# EAGLE design 180 schematic 3 layer (EAGLE 9.6.2)
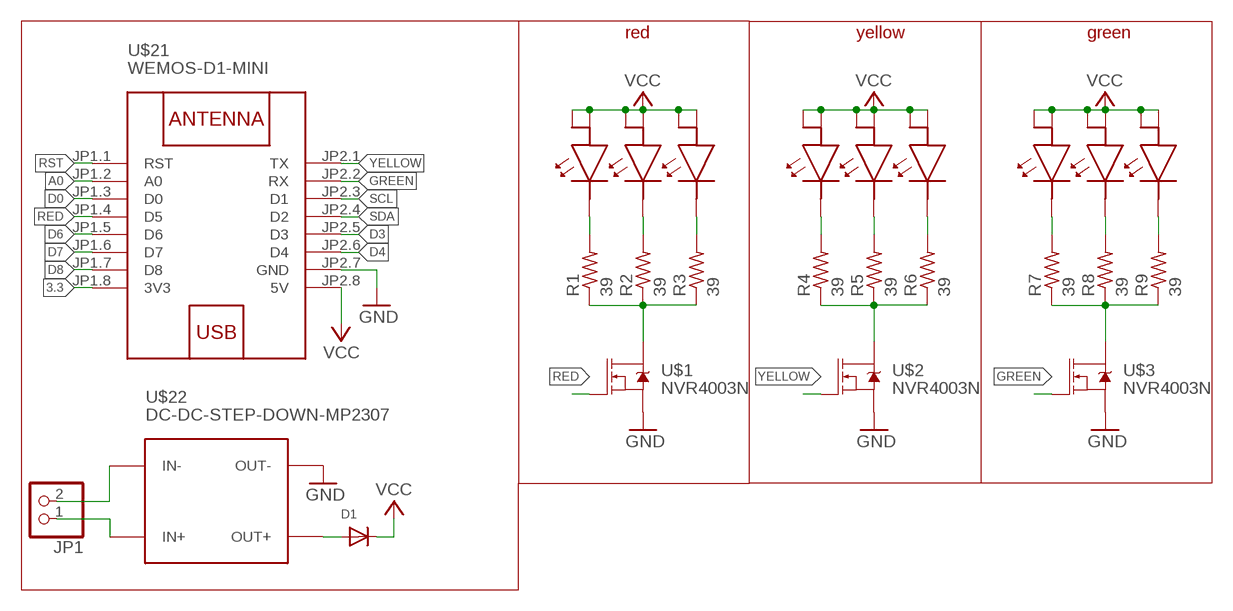
[diagram p0: schematic, sheet 1]

## Parts
D1  DIODESOD-123  [SOD-123]
JP1  PINHD-1X2  [1X02]
R1  39  R-US_R1206W  [R1206W]
R2  39  R-US_R1206W  [R1206W]
R3  39  R-US_R1206W  [R1206W]
R4  39  R-US_R1206W  [R1206W]
R5  39  R-US_R1206W  [R1206W]
R6  39  R-US_R1206W  [R1206W]
R7  39  R-US_R1206W  [R1206W]
R8  39  R-US_R1206W  [R1206W]
R9  39  R-US_R1206W  [R1206W]
U$1  NVR4003N  [SOT23]
U$2  NVR4003N  [SOT23]
U$3  NVR4003N  [SOT23]
U$6  5730LED  [5730LED]
U$7  5730LED  [5730LED]
U$8  5730LED  [5730LED]
U$9  5730LED  [5730LED]
U$10  5730LED  [5730LED]
U$11  5730LED  [5730LED]
U$12  5730LED  [5730LED]
U$13  5730LED  [5730LED]
U$14  5730LED  [5730LED]
U$21  WEMOS-D1-MINI  [WEMOS-D1-MINI]
U$22  DC-DC-STEP-DOWN-MP2307  [DC-DC-STEP-DOWN-MP2307]

## Nets
3.3: U$21.JP1.8(3V3)
A0: U$21.JP1.2(A0)
D0: U$21.JP1.3(D0)
D3: U$21.JP2.5(D3)
D4: U$21.JP2.6(D4)
D6: U$21.JP1.5(D6)
D7: U$21.JP1.6(D7)
D8: U$21.JP1.7(D8)
GND: U$1.3(S) U$2.3(S) U$3.3(S) U$21.JP2.7(GND) U$22.OUT-
GREEN: U$3.2(G) U$21.JP2.2(RX)
N$1: D1.A U$22.OUT+
N$2: JP1.2 U$22.IN-
N$3: JP1.1 U$22.IN+
N$6: R1.2 U$6.P$2
N$7: R2.2 U$7.P$2
N$8: R3.2 U$8.P$2
N$9: R4.2 U$9.P$2
N$10: R5.2 U$10.P$2
N$11: R6.2 U$11.P$2
N$12: R7.2 U$12.P$2
N$13: R8.2 U$13.P$2
N$20: R9.2 U$14.P$2
N$21: R1.1 R2.1 R3.1 U$1.1(D)
N$22: R4.1 R5.1 R6.1 U$2.1(D)
N$23: R7.1 R8.1 R9.1 U$3.1(D)
RED: U$1.2(G) U$21.JP1.4(D5)
RST: U$21.JP1.1(RST)
SCL: U$21.JP2.3(D1)
SDA: U$21.JP2.4(D2)
VCC: D1.C U$6.P$1 U$6.P$3 U$7.P$1 U$7.P$3 U$8.P$1 U$8.P$3 U$9.P$1 U$9.P$3 U$10.P$1 U$10.P$3 U$11.P$1 U$11.P$3 U$12.P$1 U$12.P$3 U$13.P$1 U$13.P$3 U$14.P$1 U$14.P$3 U$21.JP2.8(5V)
YELLOW: U$2.2(G) U$21.JP2.1(TX)

## Notes on the sheet
- red | yellow | green

## Library data of the parts
D1 = adafruit:DIODE: Diode SMADIODE - SMA Surface Mount Package 20V 1A Schottky Diode Digikey: 641-1014-6-ND DO-1N4148 - Through Hole Small Current Diode SOD-123 20V 1 A (.5mV Vf) Schottky Diode - Digikey: MBRX120TPMSCT-ND SOD-323 10V 570mA (.38mV Vf, 3ns) Schottky Diode - Digikey: ZLLS410CT-ND SOD-523 30V 30mA Schottky Diode (RB751S-40TE61) - Digikey: RB751S-40TE61CT-ND SOT23-R/W - SOT23 Package (R = Solder Paste/Reflow Ovens, W = Hand-Soldering) BAT54Film 40V 300mA - Digikey: 497-7162-1-ND
JP1 = pinhead:PINHD-1X2: PIN HEADER
R1-R9 = resistor:R-US_: RESISTOR, American symbol
U$1-U$3 = custom parts:NVR4003N
U$6-U$14 = custom parts:5730LED
U$21 = diy-modules:WEMOS-D1-MINI: WEMOS D1 mini: Mini Wi-Fi Board based on ESP-8266 device More details can be found here: https://www.wemos.cc/product/d1-mini.html Click here to find device on ebay.com <http://www.ebay.com/sch/wemos+d1+mini+nodemcu>
U$22 = diy-modules:DC-DC-STEP-DOWN-MP2307: DC/DC Step-Down Regulator based on MP2307DN chip MP2307 datasheet available here: https://cdn-shop.adafruit.com/datasheets/MP2307_r1.9.pdf Click here to find device on ebay.com <http://www.ebay.com/sch/dc+dc+3a+mini+converter>

## Board
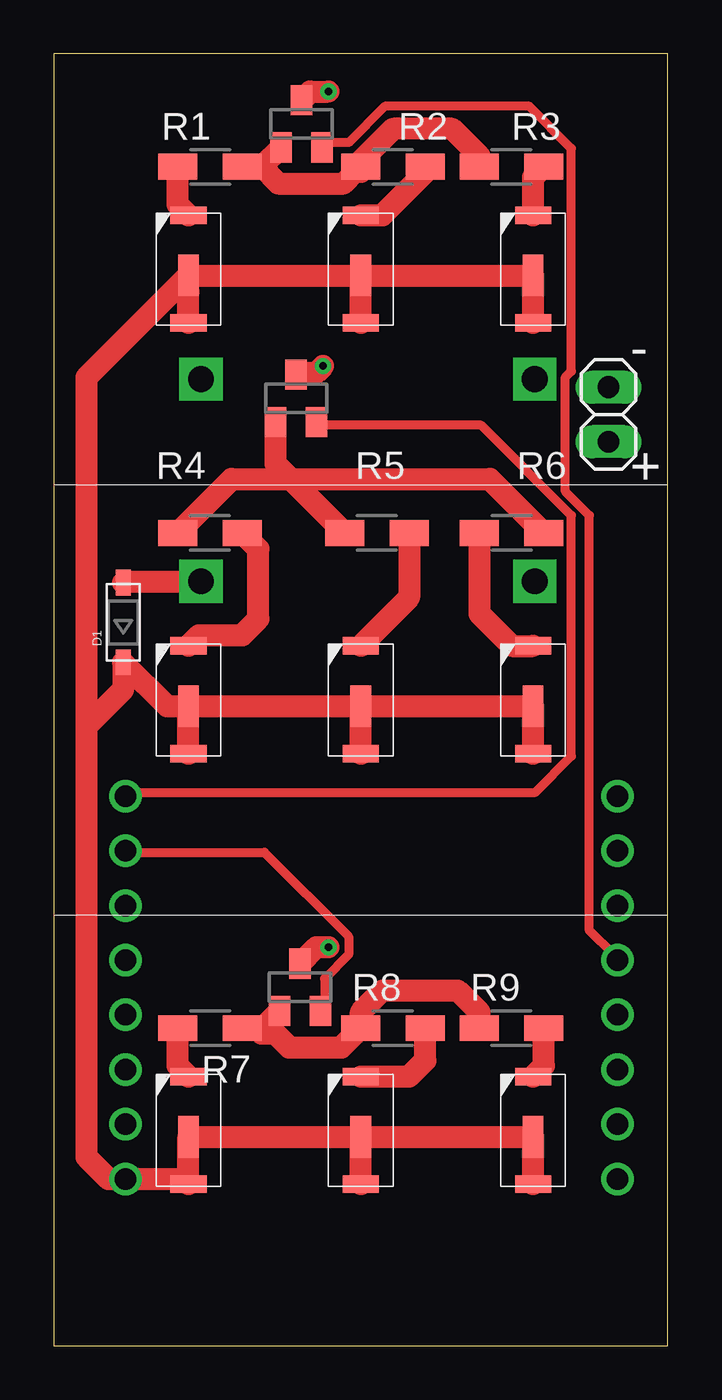
[diagram p1: board, top side]
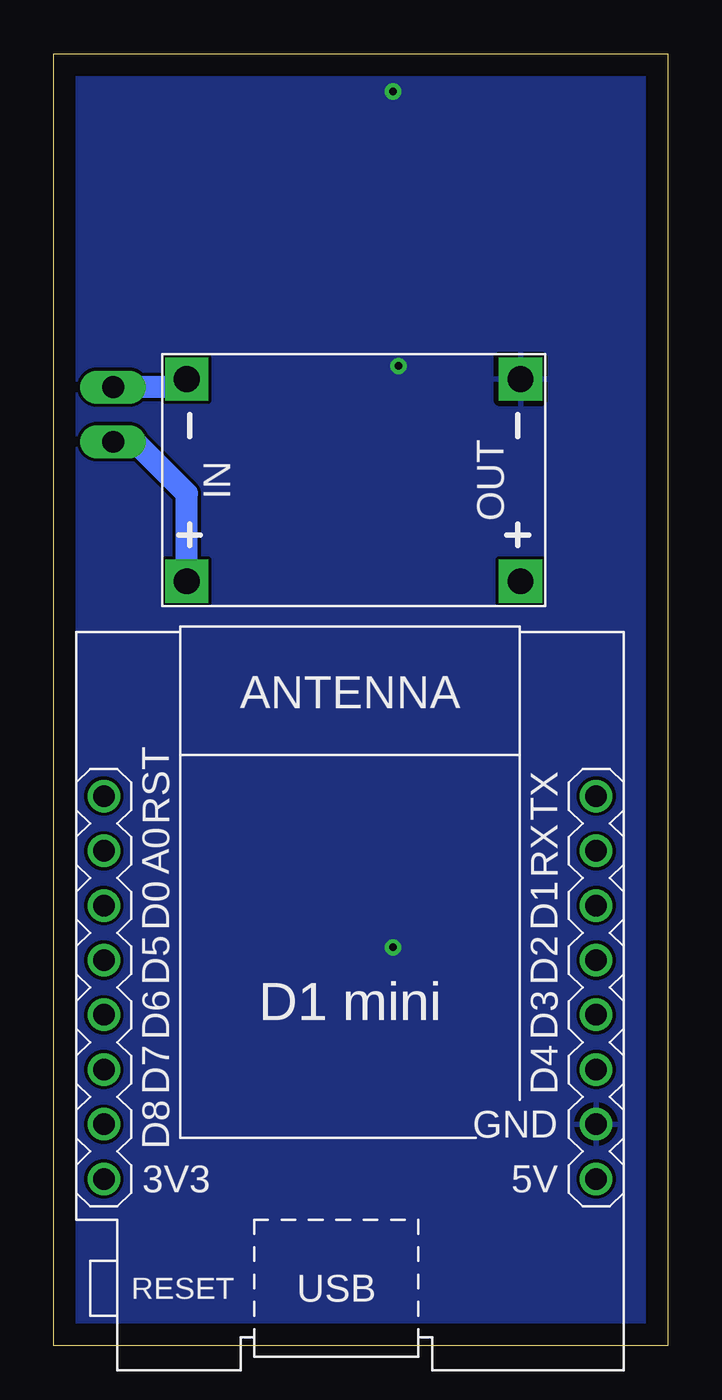
[diagram p2: board, bottom side, seen from below]

Size 28.5 x 60 mm. Coordinates in mm from the lower left corner, seen from the top.
Outline: 0,0 28.5,0 28.5,60 0,60 0,0
Copper layers (1*16): Top 0.035mm / dielectric 1.5mm / Bottom 0.035mm
Design rules "default *": minimum track width 16mil, minimum drill 0.35mm, track to track 6mil, track to pad 6mil, pad to pad 6mil, via to via 6mil, smd to smd 6mil, copper to edge 40mil, drill to drill 6mil, minimum pad ring 10mil, minimum via ring 8mil, stop-mask expansion 4mil, vias tented up to drill 0mil, thermal gap 10mil

### Footprints (pad centres in the part's own frame; a part is rotated, then mirrored left to right if it is on the bottom)
SOD-123 = smd 1.2 x 0.7: A 1.85,0; C -1.85,0
1X02 = drill 1.016 long: 1 -1.27,0; 2 1.27,0
R1206W = smd 1.8 x 1.2: 1 -1.499,0; 2 1.499,0
SOT23 = smd 1 x 1.4: 1 -0.95,-1.1; 2 0.95,-1.1; 3 0,1.1
5730LED = smd 0.813 x 1.676: P$1 -2.5,0; P$2 2.5,0 | smd 1.93 x 0.965: P$3 -0.3,0
WEMOS-D1-MINI = drill 1: JP1.1 -11.43,9.525; JP1.2 -11.43,6.985; JP1.3 -11.43,4.445; JP1.4 -11.43,1.905; JP1.5 -11.43,-0.635; JP1.6 -11.43,-3.175; JP1.7 -11.43,-5.715; JP1.8 -11.43,-8.255; JP2.1 11.43,9.525; JP2.2 11.43,6.985; JP2.3 11.43,4.445; JP2.4 11.43,1.905; JP2.5 11.43,-0.635; JP2.6 11.43,-3.175; JP2.7 11.43,-5.715; JP2.8 11.43,-8.255
DC-DC-STEP-DOWN-MP2307 = drill 1.2 pad 2 square: IN+ -7.747,-4.699; IN- -7.747,4.699; OUT+ 7.747,-4.699; OUT- 7.747,4.699

### Placement (x,y rotation side)
D1  3.22,33.59 90 top
JP1  25.75,43.25 90 top
R1  7.25,54.75 180 top
R2  15.75,54.75 0 top
R3  21.25,54.75 0 top
R4  7.25,37.75 0 top
R5  15,37.75 0 top
R6  21.25,37.75 180 top
R7  7.25,14.75 180 top
R8  15.75,14.75 0 top
R9  21.25,14.75 0 top
U$1  11.5,56.75 0 top
U$2  11.25,44 0 top
U$3  11.43,16.64 0 top
U$6  6.25,50 90 top
U$7  14.25,50 90 top
U$8  22.25,50 90 top
U$9  6.25,30 90 top
U$10  14.25,30 90 top
U$11  22.25,30 90 top
U$12  6.25,10 90 top
U$13  14.25,10 90 top
U$14  22.25,10 90 top
U$21  14.75,16 0 bottom
U$22  14.58,40.2 0 bottom

### Tracks (layer width: path | path; a pad name or v marks a point on that pad's centre or on a via)
GND  (via drill 0.35)
  Top 1.016: v12.5,45.5 12.18,45.17 11.68,45.17 11.6,45.1 U$2.3 | U$1.3 11.9,58.25 v12.75,58.25 | U$3.3 12.19,18.5 v12.75,18.5
  pour Bottom: 0,60 0,0 28.5,0 28.5,60
GREEN
  Top 0.406: U$3.2 12.57,15.65 12.57,17.04 13.69,18.16 13.69,19 9.78,22.91 3.35,22.91 U$21.JP2.2
N$1
  Top 1.016: D1.A 3.28,35.5 U$22.OUT+
N$2
  Bottom 1.016: U$22.IN- 22.71,44.52 JP1.2
N$3
  Bottom 1.016: U$22.IN+ 22.33,39.58 24.75,42 25.73,42 JP1.1
N$6
  Top 1.016: U$6.P$2 5.75,53 R1.2
N$7
  Top 1.016: U$7.P$2 15.25,52.5 17.25,54.5 R2.2
N$8
  Top 1.016: U$8.P$2 22.25,54.25 R3.2
N$9
  Top 1.016: U$9.P$2 6.75,33 8.75,33 9.5,33.75 9.5,37 R4.2
N$10
  Top 1.016: R5.2 16.5,34.75 U$10.P$2
N$11
  Top 1.016: R6.2 19.75,34 21.25,32.5 U$11.P$2
N$12
  Top 1.016: U$12.P$2 5.75,13 R7.2
N$13
  Top 1.016: U$13.P$2 16.5,12.5 17.25,13.25 R8.2
N$20
  Top 1.016: U$14.P$2 22.75,13 R9.2
N$21
  Top 1.016: R3.1 19.75,55.26 18.49,56.52 15.75,56.52 14.25,55.02 R2.1 14.25,54.52 14,54.52 13.46,53.98 10.42,53.98 9.64,54.75 R1.1 9.65,54.75 U$1.1
N$22
  Top 1.016: R4.1 8.25,40.25 11,40.25 | R5.1 11,40.25 | 11,40.25 10.3,40.95 U$2.1 | 11,40.25 20.25,40.25 R6.1
N$23
  Top 1.016: R7.1 9.69,14.75 | 9.69,14.75 9.9,14.75 9.65,14.5 10.27,14.5 10.92,13.85 13.35,13.85 R8.1 14.25,15.5 15.25,16.5 18.75,16.5 19.75,15.5 R9.1 | 9.69,14.75 U$3.1
RED
  Top 0.406: U$1.2 12.57,55.88 13.69,55.88 15.37,57.56 22.07,57.56 24.03,55.6 24.03,45.26 23.75,44.98 23.75,39.67 24.87,38.56 24.87,19.28 25.98,18.16 U$21.JP1.4
VCC
  Top 1.016: U$7.P$1 U$7.P$3 | U$6.P$1 U$6.P$3 | U$6.P$3 U$7.P$3 | U$7.P$3 U$8.P$3 U$8.P$1 | U$9.P$1 U$9.P$3 | U$10.P$1 U$10.P$3 | U$11.P$1 U$11.P$3 U$10.P$3 | U$9.P$3 U$10.P$3 | U$13.P$1 U$13.P$3 | U$14.P$1 U$14.P$3 U$13.P$3 | U$13.P$3 U$12.P$3 U$12.P$1 6,7.75 U$21.JP2.8 2.53,7.75 1.52,8.75 1.52,28.77 | 6.25,48.95 U$6.P$3 | U$9.P$3 5.26,29.7 D1.C 3.22,30.47 1.52,28.77 | 1.52,28.77 1.52,44.97 U$6.P$3
YELLOW
  Top 0.406: U$2.2 12.29,42.75 19.84,42.75 24.03,38.56 24.03,27.38 22.35,25.7 3.35,25.7 U$21.JP2.1

### Text on the board
tPlace: - | +